# Altium schematic sheet Ignitions.SchDoc
size D; SheetNumber: 6; SheetTotal: 8
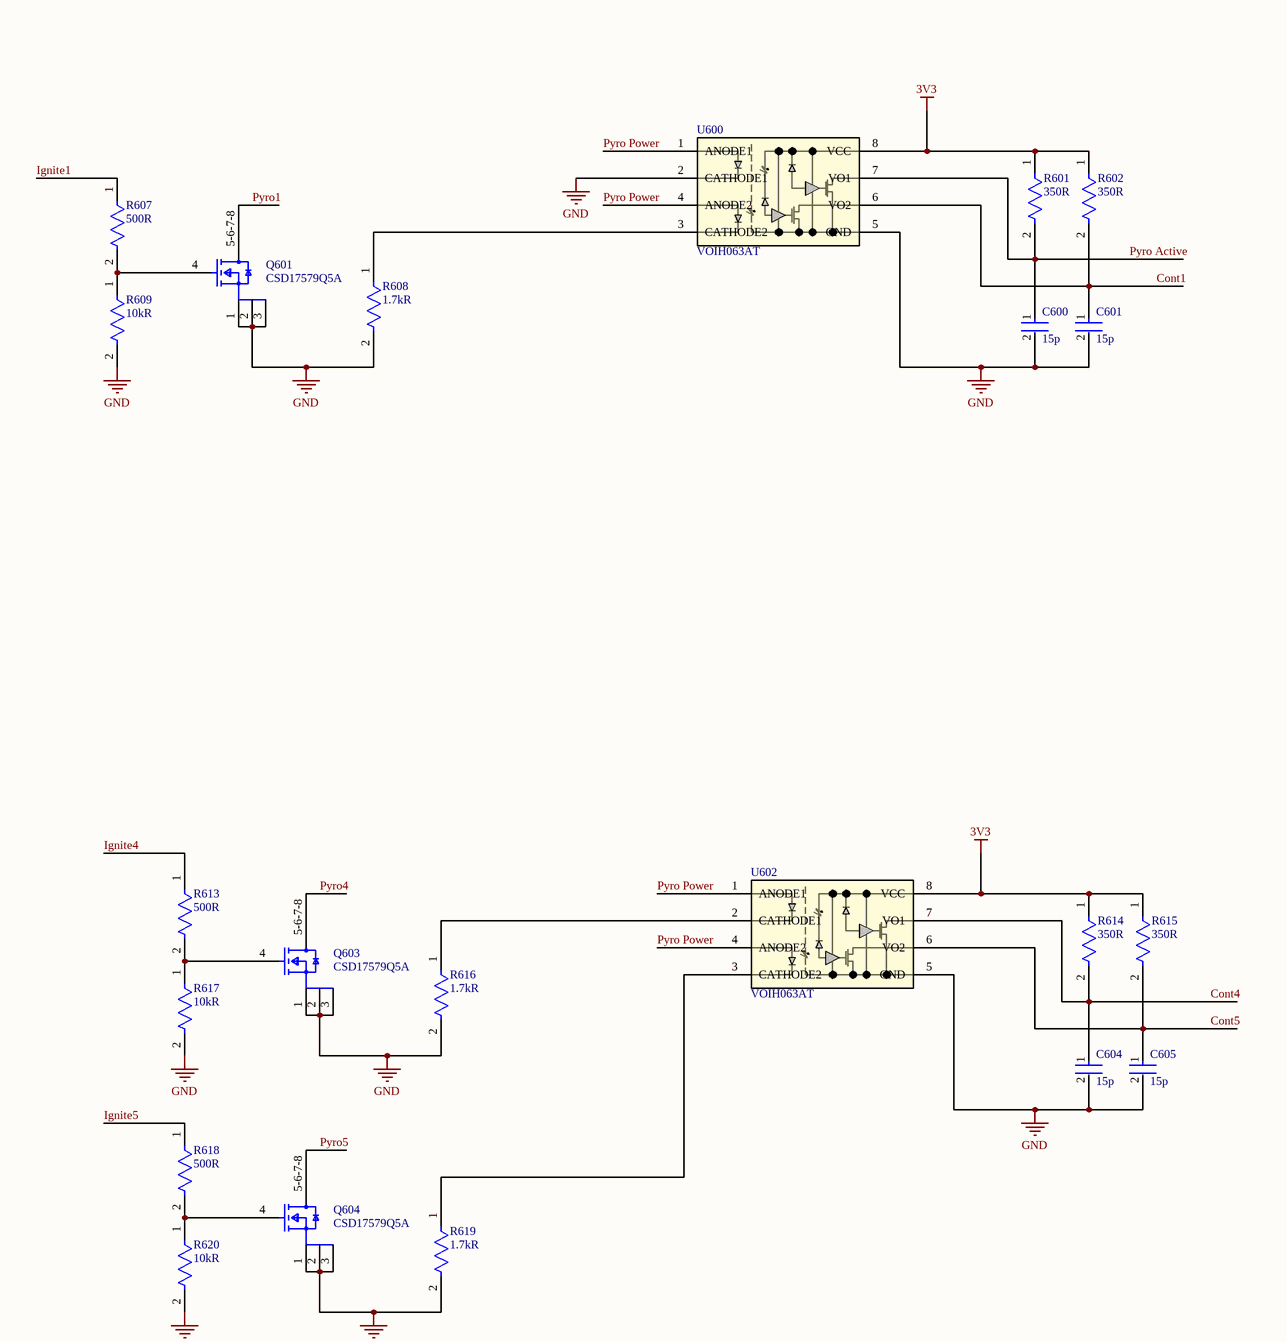
[diagram p0: Ignitions.SchDoc, top left]
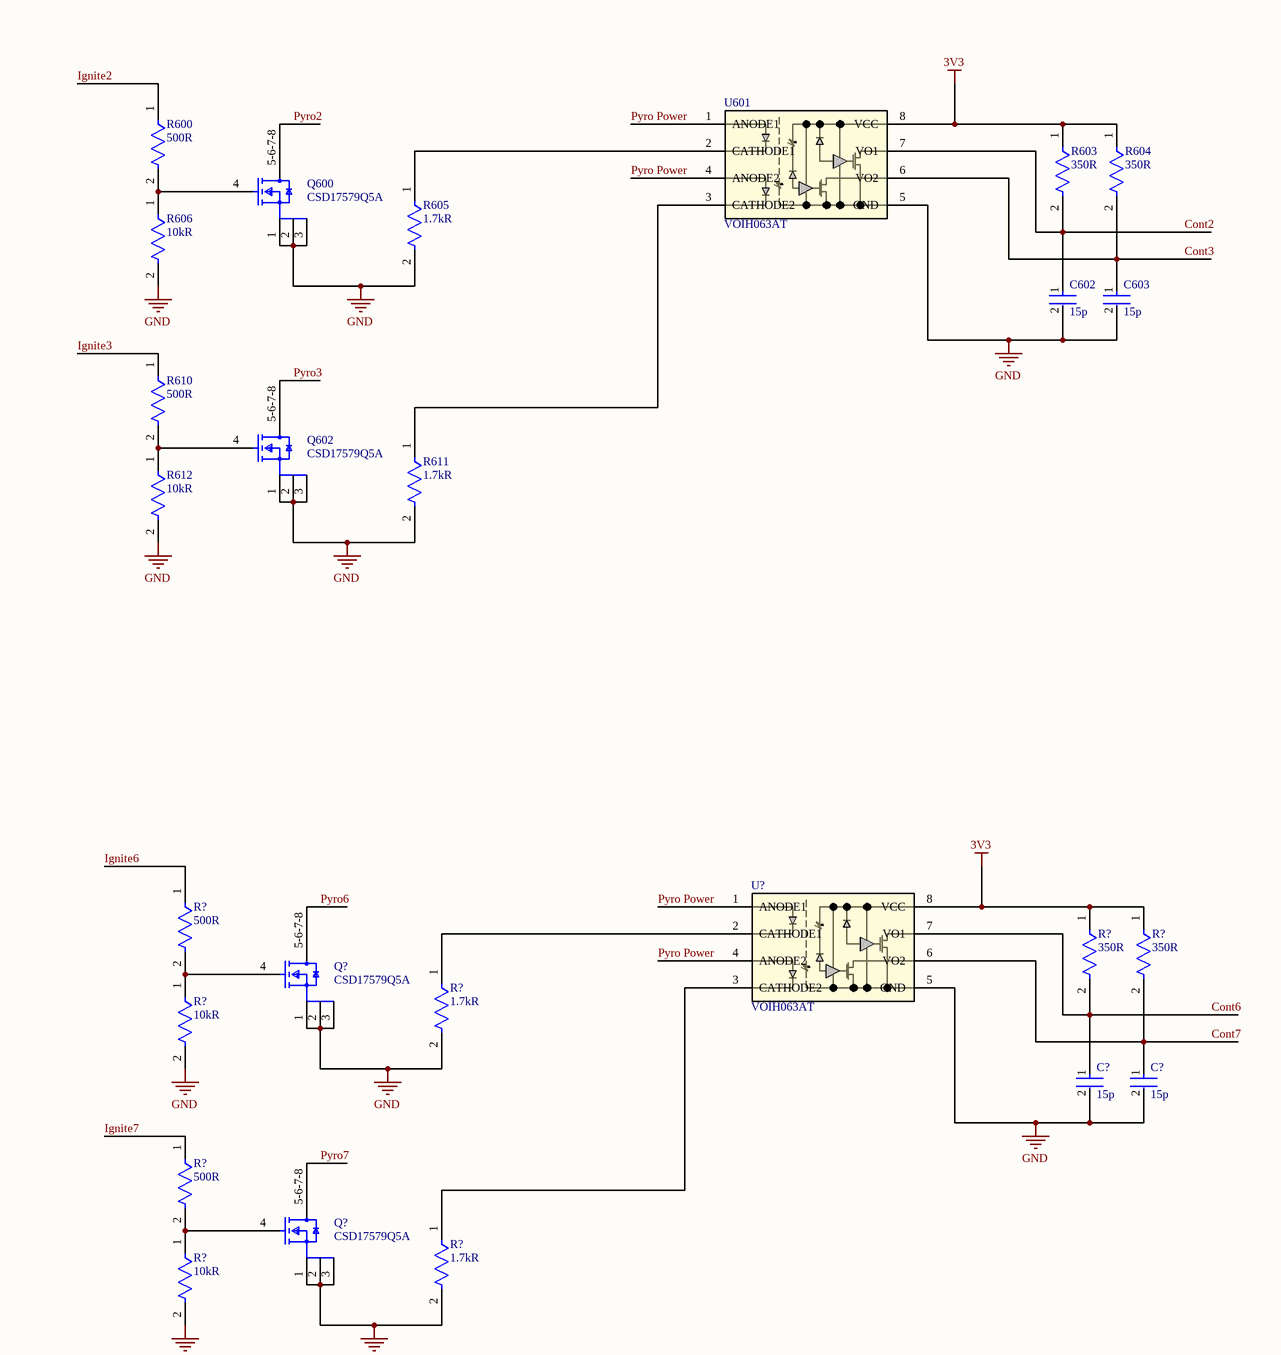
[diagram p1: Ignitions.SchDoc, top right]
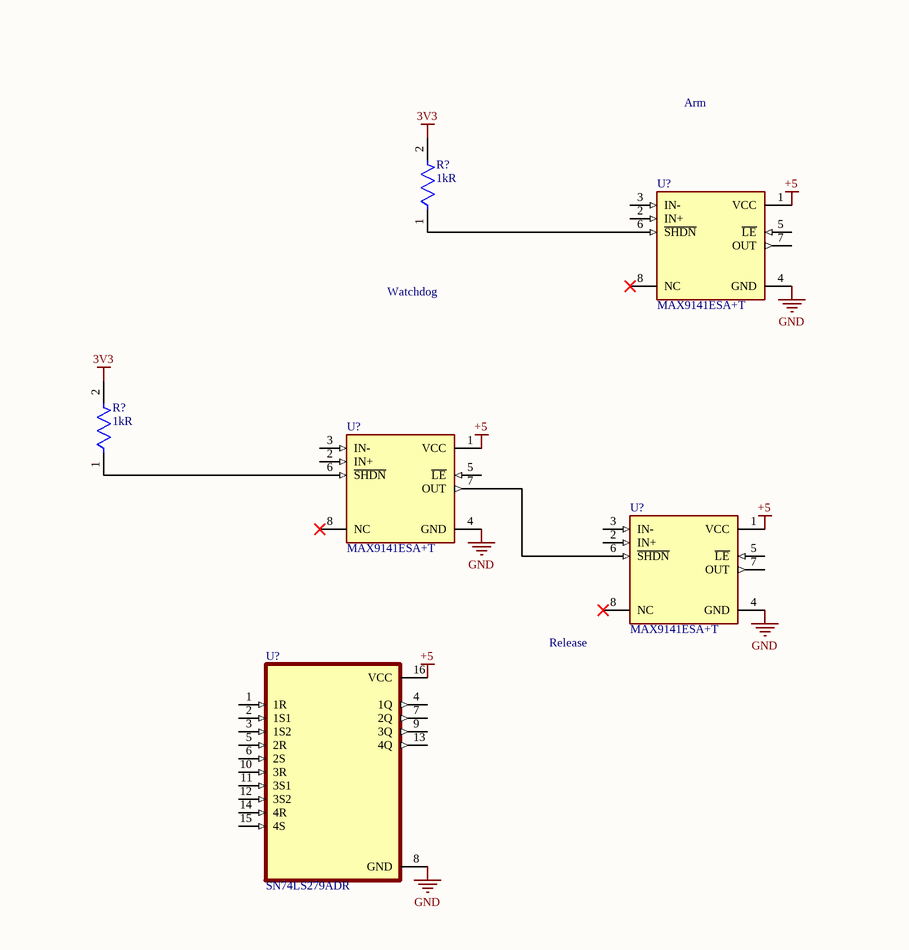
[diagram p2: Ignitions.SchDoc, bottom left]
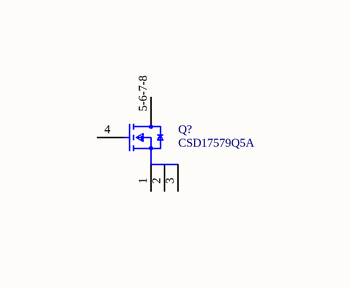
[diagram p3: Ignitions.SchDoc, bottom right]

## Parts
(Parts that share a designator on the sheet are numbered #1, #2 ... from top to bottom, then left to right.)
C600  Capacitance: 15p  [FP-CL10-IPC_A]  (hidden comment: CL10C681JB8NFNC)
C601  Capacitance: 15p  [FP-CL10-IPC_A]  (hidden comment: CL10C681JB8NFNC)
C602  Capacitance: 15p  [FP-CL10-IPC_A]  (hidden comment: CL10C681JB8NFNC)
C603  Capacitance: 15p  [FP-CL10-IPC_A]  (hidden comment: CL10C681JB8NFNC)
C604  Capacitance: 15p  [FP-CL10-IPC_A]  (hidden comment: CL10C681JB8NFNC)
C605  Capacitance: 15p  [FP-CL10-IPC_A]  (hidden comment: CL10C681JB8NFNC)
C?#1  Capacitance: 15p  [FP-CL10-IPC_A]  (hidden comment: CL10C681JB8NFNC)
C?#2  Capacitance: 15p  [FP-CL10-IPC_A]  (hidden comment: CL10C681JB8NFNC)
Q600  CSD17579Q5A  [FP-DQJ0008A-MFG]
Q601  CSD17579Q5A  [FP-DQJ0008A-MFG]
Q602  CSD17579Q5A  [FP-DQJ0008A-MFG]
Q603  CSD17579Q5A  [FP-DQJ0008A-MFG]
Q604  CSD17579Q5A  [FP-DQJ0008A-MFG]
Q?#1  CSD17579Q5A  [FP-DQJ0008A-MFG]
Q?#2  CSD17579Q5A  [FP-DQJ0008A-MFG]
Q?#3  CSD17579Q5A  [FP-DQJ0008A-MFG]
R600  value 500R  [FP-CPF0603-MFG]  (hidden comment: CPF0603B2K15E1)
R601  value 350R  [FP-CPF0603-MFG]  (hidden comment: CPF0603B2K15E1)
R602  value 350R  [FP-CPF0603-MFG]  (hidden comment: CPF0603B2K15E1)
R603  value 350R  [FP-CPF0603-MFG]  (hidden comment: CPF0603B2K15E1)
R604  value 350R  [FP-CPF0603-MFG]  (hidden comment: CPF0603B2K15E1)
R605  value 1.7kR  [FP-CPF0603-MFG]  (hidden comment: CPF0603B2K15E1)
R606  value 10kR  [FP-CPF0603-MFG]  (hidden comment: CPF0603B2K15E1)
R607  value 500R  [FP-CPF0603-MFG]  (hidden comment: CPF0603B2K15E1)
R608  value 1.7kR  [FP-CPF0603-MFG]  (hidden comment: CPF0603B2K15E1)
R609  value 10kR  [FP-CPF0603-MFG]  (hidden comment: CPF0603B2K15E1)
R610  value 500R  [FP-CPF0603-MFG]  (hidden comment: CPF0603B2K15E1)
R611  value 1.7kR  [FP-CPF0603-MFG]  (hidden comment: CPF0603B2K15E1)
R612  value 10kR  [FP-CPF0603-MFG]  (hidden comment: CPF0603B2K15E1)
R613  value 500R  [FP-CPF0603-MFG]  (hidden comment: CPF0603B2K15E1)
R614  value 350R  [FP-CPF0603-MFG]  (hidden comment: CPF0603B2K15E1)
R615  value 350R  [FP-CPF0603-MFG]  (hidden comment: CPF0603B2K15E1)
R616  value 1.7kR  [FP-CPF0603-MFG]  (hidden comment: CPF0603B2K15E1)
R617  value 10kR  [FP-CPF0603-MFG]  (hidden comment: CPF0603B2K15E1)
R618  value 500R  [FP-CPF0603-MFG]  (hidden comment: CPF0603B2K15E1)
R619  value 1.7kR  [FP-CPF0603-MFG]  (hidden comment: CPF0603B2K15E1)
R620  value 10kR  [FP-CPF0603-MFG]  (hidden comment: CPF0603B2K15E1)
R?#1  value 500R  [FP-CPF0603-MFG]  (hidden comment: CPF0603B2K15E1)
R?#2  value 350R  [FP-CPF0603-MFG]  (hidden comment: CPF0603B2K15E1)
R?#3  value 350R  [FP-CPF0603-MFG]  (hidden comment: CPF0603B2K15E1)
R?#4  value 1.7kR  [FP-CPF0603-MFG]  (hidden comment: CPF0603B2K15E1)
R?#5  value 10kR  [FP-CPF0603-MFG]  (hidden comment: CPF0603B2K15E1)
R?#6  value 500R  [FP-CPF0603-MFG]  (hidden comment: CPF0603B2K15E1)
R?#7  value 1.7kR  [FP-CPF0603-MFG]  (hidden comment: CPF0603B2K15E1)
R?#8  value 10kR  [FP-CPF0603-MFG]  (hidden comment: CPF0603B2K15E1)
R?#9  value 1kR  [FP-CPF0603-MFG]  (hidden comment: CPF0603B2K15E1)
R?#10  value 1kR  [FP-CPF0603-MFG]  (hidden comment: CPF0603B2K15E1)
U600  VOIH063AT  [SOIC-8_VOIH063A_VIS]
U601  VOIH063AT  [SOIC-8_VOIH063A_VIS]
U602  VOIH063AT  [SOIC-8_VOIH063A_VIS]
U?#1  VOIH063AT  [SOIC-8_VOIH063A_VIS]
U?#2  MAX9141ESA+T  [SOIC127P600X175-8N]
U?#3  MAX9141ESA+T  [SOIC127P600X175-8N]
U?#4  MAX9141ESA+T  [SOIC127P600X175-8N]
U?#5  SN74LS279ADR  [SOIC127P600X175-16N]

## Nets
3V3: R601.1 R602.1 R603.1 R604.1 R614.1 R615.1 R?#2.1 R?#3.1 R?#9.2 R?#10.2 U600.8(VCC) U601.8(VCC) U602.8(VCC) U?#1.8(VCC)
+5: U?#2.1(VCC) U?#3.1(VCC) U?#4.1(VCC) U?#5.16(VCC)
GND: C600.2 C601.2 C602.2 C603.2 C604.2 C605.2 C?#1.2 C?#2.2 Q600.1(S) Q600.2(S) Q600.3(S) Q601.1(S) Q601.2(S) Q601.3(S) Q602.1(S) Q602.2(S) Q602.3(S) Q603.1(S) Q603.2(S) Q603.3(S) Q604.1(S) Q604.2(S) Q604.3(S) Q?#1.1(S) Q?#1.2(S) Q?#1.3(S) Q?#2.1(S) Q?#2.2(S) Q?#2.3(S) R605.2 R606.2 R608.2 R609.2 R611.2 R612.2 R616.2 R617.2 R619.2 R620.2 R?#4.2 R?#5.2 R?#7.2 R?#8.2 U600.2(CATHODE1) U600.5(GND) U601.5(GND) U602.5(GND) U?#1.5(GND) U?#2.4(GND) U?#3.4(GND) U?#4.4(GND) U?#5.8(GND)
Cont1: C601.1 R602.2 U600.6(VO2)
Cont2: C602.1 R603.2 U601.7(VO1)
Cont3: C603.1 R604.2 U601.6(VO2)
Cont4: C604.1 R614.2 U602.7(VO1)
Cont5: C605.1 R615.2 U602.6(VO2)
Cont6: C?#1.1 R?#2.2 U?#1.7(VO1)
Cont7: C?#2.1 R?#3.2 U?#1.6(VO2)
Ignite1: R607.1
Ignite2: R600.1
Ignite3: R610.1
Ignite4: R613.1
Ignite5: R618.1
Ignite6: R?#1.1
Ignite7: R?#6.1
Pyro1: Q601.5-6-7-8(D)
Pyro2: Q600.5-6-7-8(D)
Pyro3: Q602.5-6-7-8(D)
Pyro4: Q603.5-6-7-8(D)
Pyro5: Q604.5-6-7-8(D)
Pyro6: Q?#1.5-6-7-8(D)
Pyro7: Q?#2.5-6-7-8(D)
Pyro Active: C600.1 R601.2 U600.7(VO1)
Pyro Power: U600.1(ANODE1) U600.4(ANODE2) U601.1(ANODE1) U601.4(ANODE2) U602.1(ANODE1) U602.4(ANODE2) U?#1.1(ANODE1) U?#1.4(ANODE2)
NetQ600_4: Q600.4(G) R600.2 R606.1
NetQ601_4: Q601.4(G) R607.2 R609.1
NetQ602_4: Q602.4(G) R610.2 R612.1
NetQ603_4: Q603.4(G) R613.2 R617.1
NetQ604_4: Q604.4(G) R618.2 R620.1
NetQ?#1_4: Q?#1.4(G) R?#1.2 R?#5.1
NetQ?#2_4: Q?#2.4(G) R?#6.2 R?#8.1
NetR605_1: R605.1 U601.2(CATHODE1)
NetR608_1: R608.1 U600.3(CATHODE2)
NetR611_1: R611.1 U601.3(CATHODE2)
NetR616_1: R616.1 U602.2(CATHODE1)
NetR619_1: R619.1 U602.3(CATHODE2)
NetR?#4_1: R?#4.1 U?#1.2(CATHODE1)
NetR?#7_1: R?#7.1 U?#1.3(CATHODE2)
NetR?#9_1: R?#9.1 U?#2.6(~{SHDN})
NetR?#10_1: R?#10.1 U?#3.6(~{SHDN})
NetU?#3_7: U?#3.7(OUT) U?#4.6(~{SHDN})

Not connected (* = marked no-connect by the designer): Q?#3 1(S) 2(S) 3(S) 4(G) 5-6-7-8(D); U?#2 2(IN+) 3(IN-) 5(~{LE}) 7(OUT) 8(NC)*; U?#3 2(IN+) 3(IN-) 5(~{LE}) 8(NC)*; U?#4 2(IN+) 3(IN-) 5(~{LE}) 7(OUT) 8(NC)*; U?#5 1(1R) 2(1S1) 3(1S2) 4(1Q) 5(2R) 6(2S) 7(2Q) 9(3Q) 10(3R) 11(3S1) 12(3S2) 13(4Q) 14(4R) 15(4S)

## Notes on the sheet
- Arm
- Watchdog
- (near U?#4) Release

## Library data of the parts
C600-C605 C?#1 C?#2 = CMP-13271-001533-1: Cap Ceramic 680pF 50V C0G ±5% Pad SMD 0603 +125°C T/R; Voltage Rating: 50V; Radiation Hardening: No; Length: 0.063inch; Min Operating Temperature: -55°C; Package Quantity: 1; Lead Free: Lead Free; Case Code (Metric): 1608; Thickness: 0.035inch; Width: 0.031inch; Height: 0.8mm; Case/Package: 0603; Tolerance: 5%; Mount: Surface Mount; Dielectric: C0G; Max Operating Temperature: 125°C; Case Code (Imperial): 0603; Packaging: Tape and Reel; Depth: 0.8mm
Q600-Q604 Q?#1-Q?#3 = CMP-013-00034-3: 30V, N ch NexFET MOSFET, single SON5x6, 13.3mOhm 8-VSONP; MF: Texas Instruments; Terminal Finish: Tin; Reach SVHC Compliant: No; RoHS Compliant: Yes; Availability: In Stock; SnapEDA_Link: https://www.snapeda.com/parts/CSD17579Q5A/Texas+Instruments/view-part/?ref=snap; Value: *; Design Item ID: CSD17579Q5A; Check_prices: https://www.snapeda.com/parts/CSD17579Q5A/Texas+Instruments/view-part/?ref=eda; JESD-609 Code: e3; Price: None; Source: CSD17579Q5A.SchLib; Pins: 8; Moisture Sensitivity Level: 1; Purchase-URL: https://pricing.snapeda.com/search/part/CSD17579Q5A/?ref=eda; Case/Package: VSONP-8 Texas Instruments; Component Type: Standard; MP: CSD17579Q5A; Peak Reflow Temperature (Cel): 260°C
R600-R620 R?#1-R?#10 = CMP-03211-008657-1: RES SMD 2.15KΩ 0.1% 1/16W 0603; Manufacturer: TE Connectivity; Temperature Coefficient: 25ppm/°C; Voltage Rating: 50V; Power Rating: 0.063W; Height: 0.55mm; Series: CPF; ComponentLink2Description: Datasheet; Package: CPF0603; Automotive: No; octopart_url: https://octopart.com/cpf0603b2k15e1-te+connectivity-22739551; Lead Free: Yes; Temperature: -55°C to +155°C; RoHS: TRUE; Ipc Land Pattern Name: RESC15580X45; Temperature Range Low: -55°C; Composition: Thin Film; Device Class L3: Chip SMD Resistors; Category: Res; Octopart: https://octopart.com/cpf0603b2k15e1-te+connectivity-22739551; Resistance: 2.15KΩ; ComponentLink2URL: https://www.te.com/commerce/DocumentDelivery/DDEController?Action=showdoc&DocId=Data+Sheet%7F1773200%7FM%7Fpdf%7FEnglish%7FENG_DS_1773200_M.pdf%7F3-1676481-2; Manufacturer Part Number: CPF0603B2K15E1; packaging: 1k Reel; Tolerance: 0.1%; Temperature Range High: +155°C; Device Class L1: Passive Components; Device Class L2: Resistors
U600-U602 U?#1 = CMP-053-000000-2: No Description Available; Mfr_Name: Vishay; RefDes: RefDes; Type: Type; Source: VOIH063AT.SchLib; Design Item ID: VOIH063AT
U?#2-U?#4 = CMP-079-000000-2: 40ns, Low-Power, 3V/5V, Rail-to-Rail Single-Supply Comparators; MF: Analog Devices; Value: *; Design Item ID: MAX9141ESA+T; Pin Count: 7; SnapEDA_Link: https://www.snapeda.com/parts/MAX9141ESA+T/Analog+Devices/view-part/?ref=snap; Source: MAX9141ESA+T.SchLib; MP: MAX9141ESA+T; Check_prices: https://www.snapeda.com/parts/MAX9141ESA+T/Analog+Devices/view-part/?ref=eda; Component Type: Standard; Package: SOIC-8 Maxim
U?#5 = CMP-081-000000-1: Package: None; Design Item ID: SN74LS279ADR; Availability: Unavailable; Pin Count: 16; Component Type: Standard; MP: SN74LS279ADR; Source: SN74LS279ADR.SchLib; Value: *; Price: None